# EAGLE schematic dual_sensor (EAGLE 8.7.0)
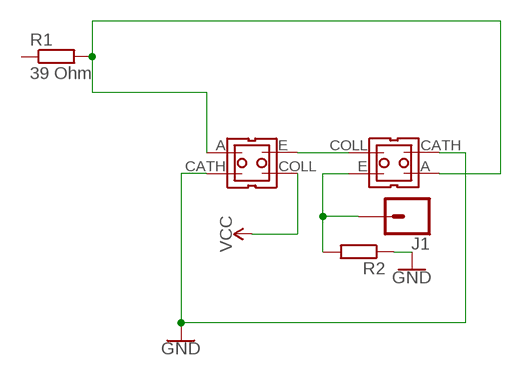
[diagram p0: schematic, sheet 1]

## Parts
J1  CONN_01  [1X01]
R1  39 Ohm  R-EU_0204/5  [0204/5]
R2  R-EU_0204/5  [0204/5]
U$1  CNY70  [CNY70]
U$2  CNY70  [CNY70]

## Nets
GND: R2.1 U$1.CATH(GND(DIG)) U$2.CATH(GND(DIG))
N$1: R1.2 U$1.A(5V(DIG)) U$2.A(5V(DIG))
N$2: U$1.E(GND(PWR)) U$2.COLL(5V(PWR))
N$3: J1.1 R2.2 U$2.E(GND(PWR))
VCC: U$1.COLL(5V(PWR))
Unconnected: R1.1

## Library data of the parts
J1 = SparkFun-Connectors:CONN_01: Single connection point. Often used as Generic Header-pin footprint for 0.1 inch spaced/style header connections On any of the 0.1 inch spaced packages, you can populate with these: Break Away Headers - Straight <https://www.sparkfun.com/products/116> (PRT-00116) Break Away Male Headers - Right Angle <https://www.sparkfun.com/products/553> (PRT-00553) Female Headers <https://www.sparkfun.com/products/115> (PRT-00115) Break Away Headers - Machine Pin <https://www.sparkfun.com/products/117> (PRT-00117) Break Away Female Headers - Swiss Machine Pin <https://www.sparkfun.com/products/743> (PRT-00743) This device is also useful as a general connection point to wire up your design to another part of your project. Our various solder wires solder well into these plated through hole pads. Hook-Up Wire - Assortment (Stranded, 22 AWG) <https://www.sparkfun.com/products/11375> (PRT-11375) Hook-Up Wire - Assortment (Solid Core, 22 AWG) <https://www.sparkfun.com/products/11367> (PRT-11367) View the entire wire category on our website here <https://www.sparkfun.com/categories/141> Special notes: SMTSO-256-ET is a "flush mount" nut for a 4-40 screw. We mostly use this on specialty testbeds; it is a nice way to connect hardware to your PCB at an adjustable hieght. Also note, the SNAP packages are for using a snappable style connector. We sell a baggie of snaps and they are also used on two LilyPad designs: Snap Assortment - 30 pack (male and female) <https://www.sparkfun.com/products/11347> (DEV-11347) LilyPad Arduino SimpleSnap <https://www.sparkfun.com/products/10941> (DEV-10941) LilyPad SimpleSnap Protoboard <https://www.sparkfun.com/products/10940> (DEV-10940)
R1 R2 = rcl:R-EU_: RESISTOR, European symbol; SPICEPREFIX: R
U$1 U$2 = ferraris_sensor_project:CNY70